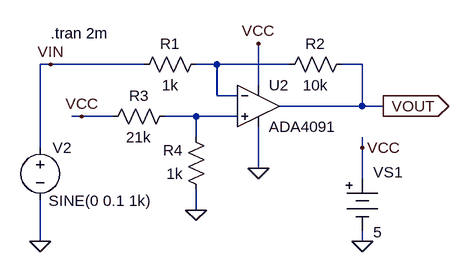
[diagram p0: schematic fig-02-01-33(b).asc]
fig-02-01-33(b).asc, the LTspice schematic file:
Version 4
SHEET 1 880 680
WIRE -112 112 -128 112
WIRE 32 112 -112 112
WIRE 144 112 112 112
WIRE 256 112 144 112
WIRE 368 112 336 112
WIRE 208 144 208 80
WIRE 144 160 144 112
WIRE 176 160 144 160
WIRE 368 176 368 112
WIRE 368 176 240 176
WIRE 400 176 368 176
WIRE -64 192 -80 192
WIRE -16 192 -64 192
WIRE 112 192 64 192
WIRE 176 192 112 192
WIRE 112 224 112 192
WIRE -128 240 -128 112
WIRE 368 240 368 224
WIRE 208 272 208 208
WIRE 368 288 368 240
WIRE 112 336 112 304
WIRE -128 384 -128 320
WIRE 368 384 368 368
FLAG 208 272 0
FLAG 400 176 VOUT
IOPIN 400 176 Out
FLAG -128 384 0
FLAG 368 384 0
FLAG 368 240 VCC
FLAG 208 80 VCC
FLAG 112 336 0
FLAG -64 192 VCC
FLAG -112 112 VIN
SYMBOL res 128 96 R90
WINDOW 0 0 56 VBottom 2
WINDOW 3 32 56 VTop 2
SYMATTR InstName R1
SYMATTR Value 1k
SYMBOL res 352 96 R90
WINDOW 0 0 56 VBottom 2
WINDOW 3 32 56 VTop 2
SYMATTR InstName R2
SYMATTR Value 10k
SYMBOL res 80 176 R90
WINDOW 0 0 56 VBottom 2
WINDOW 3 32 56 VTop 2
SYMATTR InstName R3
SYMATTR Value 21k
SYMBOL res 128 320 R180
WINDOW 0 36 76 Left 2
WINDOW 3 36 40 Left 2
SYMATTR InstName R4
SYMATTR Value 1k
SYMBOL voltage -128 224 R0
WINDOW 0 19 16 Left 2
WINDOW 3 13 98 Left 2
WINDOW 123 0 0 Left 0
WINDOW 39 0 0 Left 0
SYMATTR InstName V2
SYMATTR Value SINE(0 0.1 1k)
SYMBOL Misc\\battery 368 272 R0
WINDOW 0 17 6 Left 2
WINDOW 3 17 98 Left 2
WINDOW 123 0 0 Left 0
WINDOW 39 0 0 Left 0
SYMATTR InstName VS1
SYMATTR Value 5
SYMBOL Opamps\\ADA4091 208 112 R0
SYMATTR InstName U2
TEXT -112 64 Left 2 !.tran 2m

The netlist it stands for:
* fig-02-01-33(b).asc
R1 N001 VIN 1k
R2 VOUT N001 10k
R3 N002 VCC 21k
R4 0 N002 1k
V2 VIN 0 SINE(0 0.1 1k)
VS1 VCC 0 5
XU2 N002 N001 VCC 0 VOUT ADA4091  ; pins In+ In- V+ V- OUT
.tran 2m
.lib ADI.lib
.backanno
.end